# Altium schematic sheet STM8_DEVELOPMENT_BOARD.SchDoc
size A
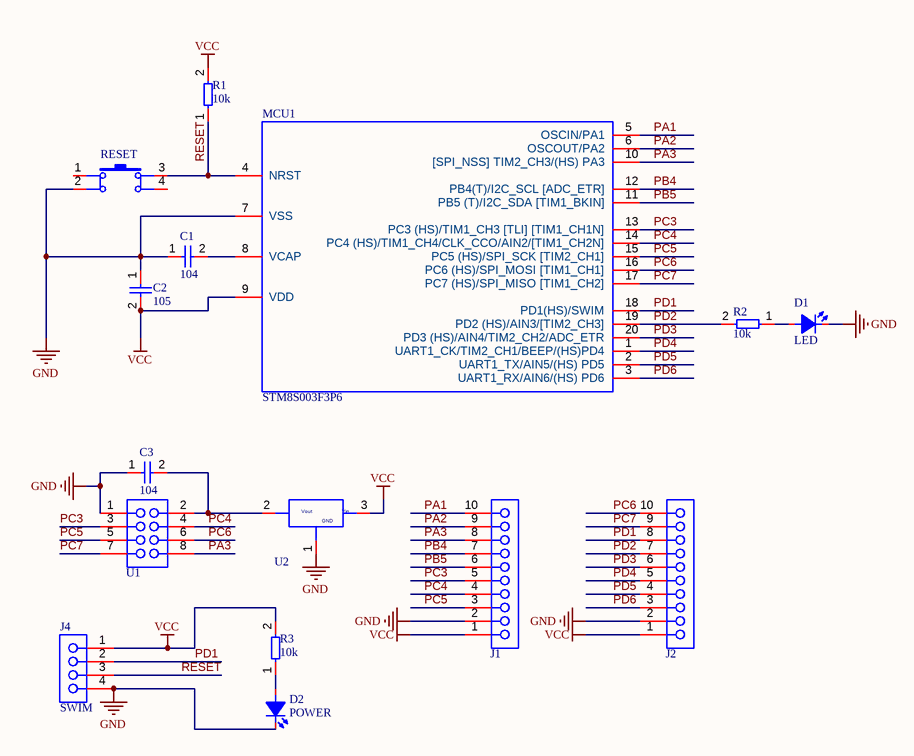
[diagram p0: STM8_DEVELOPMENT_BOARD.SchDoc]

## Parts
C1  104  [C1206]
C2  105  [C1206]
C3  104  [C1206]
D1  LED  [L0805RED]
D2  POWER  [L0805RED]
J1  Header 10x1 TH Pitch 2.54mm  [Header 10x1 TH Pitch 2.54mm]  (value not drawn)
J2  Header 10x1 TH Pitch 2.54mm  [Header 10x1 TH Pitch 2.54mm]  (value not drawn)
J4  SWIM  [HEADER 2_54 HORIZONTAL 4X]
MCU1  STM8S003F3P6  [TSSOP20_0.65_4.4]
R1  10k  [R0805]
R2  10k  [R0805]
R3  10k  [R0805]
SW1  RESET  [BUTTON_HOLE_5.0mm]
U1  nRF24L01  [Header 4x2 TH Pitch 2.54mm]  (value not drawn)
U2  AMS1117  [SOT223-3]  (value not drawn)

## Nets
GND: C1.1 C2.1 C3.1 D1.2(K) D2.2(K) J1.2 J2.2 J4.4 MCU1.7(VSS) SW1.2 U1.1 U2.1
VCC: C2.2 J1.1 J2.1 J4.1 MCU1.9(VDD) R1.2 R3.2 U2.3
PA1: J1.10 MCU1.5(OSCIN/PA1)
PA2: J1.9 MCU1.6(OSCOUT/PA2)
PA3: J1.8 MCU1.10([SPI_NSS]_TIM2_CH3/(HS)_PA3) U1.8
PB4: J1.7 MCU1.12(PB4(T)/I2C_SCL_[ADC_ETR])
PB5: J1.6 MCU1.11(PB5_(T)/I2C_SDA_[TIM1_BKIN])
PC3: J1.5 MCU1.13(PC3_(HS)/TIM1_CH3_[TLI]_[TIM1_CH1N]) U1.3
PC4: J1.4 MCU1.14(PC4_(HS)/TIM1_CH4/CLK_CCO/AIN2/[TIM1_CH2N]) U1.4
PC5: J1.3 MCU1.15(PC5_(HS)/SPI_SCK_[TIM2_CH1]) U1.5
PC6: J2.10 MCU1.16(PC6_(HS)/SPI_MOSI_[TIM1_CH1]) U1.6
PC7: J2.9 MCU1.17(PC7_(HS)/SPI_MISO_[TIM1_CH2]) U1.7
PD1: J2.8 J4.2 MCU1.18(PD1(HS)/SWIM)
PD2: J2.7 MCU1.19(PD2_(HS)/AIN3/[TIM2_CH3]) R2.2
PD3: J2.6 MCU1.20(PD3_(HS)/AIN4/TIM2_CH2/ADC_ETR)
PD4: J2.5 MCU1.1(UART1_CK/TIM2_CH1/BEEP/(HS)PD4)
PD5: J2.4 MCU1.2(UART1_TX/AIN5/(HS)_PD5)
PD6: J2.3 MCU1.3(UART1_RX/AIN6/(HS)_PD6)
RESET: J4.3 MCU1.4(NRST) R1.1 SW1.3
NetC1_2: C1.2 MCU1.8(VCAP)
NetC3_2: C3.2 U1.2 U2.2
NetD1_1: D1.1(A) R2.1
NetD2_1: D2.1(A) R3.1

Not connected (* = marked no-connect by the designer): SW1 1 4

## Notes on the sheet
- (in symbol AMS1117(SOT-223)) Vout; Vin; GND

## Library data of the parts
C1-C3 = C1206
D1 D2 = LED0805
J4 = Header 4x1 TH Pitch 2.54mm
R1-R3 = Resistor SMD
SW1 = Button Hole
U1 = Header 4x2 TH Pitch 2.54mm
U2 = AMS1117(SOT-223)